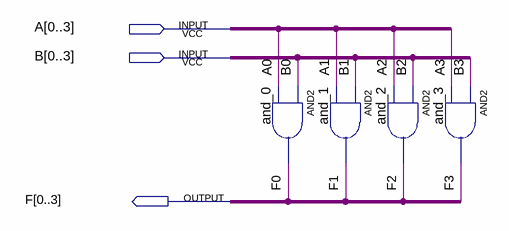
[diagram p0: schematic sheet]
// Quartus schematic four_bits_and.bdf as structural Verilog: 4 symbols, 3 pins
module four_bits_and (
  input  [0:3] A,
  input  [0:3] B,
  output [0:3] F
);

  and and_0 (F[0], B[0], A[0]);
  and and_1 (F[1], B[1], A[1]);
  and and_2 (F[2], B[2], A[2]);
  and and_3 (F[3], B[3], A[3]);
endmodule
